# EAGLE design CCR (EAGLE 8.2.2)
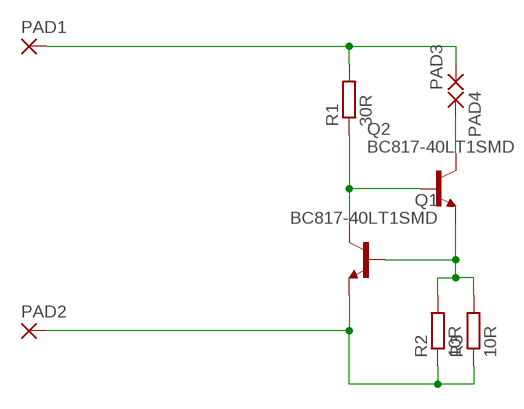
[diagram p0: schematic, sheet 1]

## Parts
PAD1  2,15/1,0  [2,15/1,0]
PAD2  2,15/1,0  [2,15/1,0]
PAD3  2,15/1,0  [2,15/1,0]
PAD4  2,15/1,0  [2,15/1,0]
Q1  BC817-40LT1SMD  [SOT23-BEC]
Q2  BC817-40LT1SMD  [SOT23-BEC]
R1  30R  R_1206  [R1206]
R2  10R  R_1206  [R1206]
R3  10R  R_1206  [R1206]

## Nets
N$1: PAD1.1(P) PAD3.1(P) R1.2
N$2: Q1.C Q2.B R1.1
N$3: PAD4.1(P) Q2.C
N$4: PAD2.1(P) Q1.E R2.1 R3.1
N$5: Q1.B Q2.E R2.2 R3.2

## Library data of the parts
PAD1-PAD4 = wirepad:2,15/1,0: THROUGH-HOLE PAD
Q1 Q2 = transistor-npn:BC817*: NPN Transistor
R1-R3 = Namenlos:R_

## Board
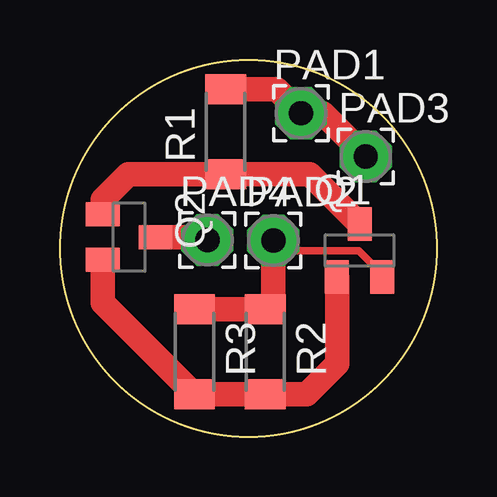
[diagram p1: board, top side]

Size 15.7 x 15.7 mm. Coordinates in mm from the lower left corner, seen from the top.
Outline: circle at 7.85,7.85 radius 7.85
Copper layers (1*16): Top 0.035mm / dielectric 1.5mm / Bottom 0.035mm
Design rules "default": minimum track width 6mil, minimum drill 0.35mm, track to track 6mil, track to pad 6mil, pad to pad 6mil, via to via 6mil, smd to smd 6mil, copper to edge 40mil, drill to drill 6mil, minimum pad ring 10mil, minimum via ring 8mil, stop-mask expansion 4mil, vias tented up to drill 0mil, thermal gap 10mil

### Footprints (pad centres in the part's own frame; a part is rotated, then mirrored left to right if it is on the bottom)
2,15/1,0 = drill 1.016 pad 2.159 octagon: 1 0,0
SOT23-BEC = smd 1 x 1.4: B -0.95,-1.1; C 0,1.1; E 0.95,-1.1
R1206 = smd 1.25 x 1.7: 1 -1.775,0; 2 1.775,0

### Placement (x,y rotation side)
PAD1  10.04,13.48 0 top
PAD2  8.89,8.18 0 top
PAD3  12.74,11.68 0 top
PAD4  6.14,8.2 0 top
Q1  12.48,7.76 0 top
Q2  2.88,8.32 270 top
R1  6.9,12.71 90 top
R2  8.55,3.55 270 top
R3  5.6,3.55 270 top

### Tracks (layer width: path | path; a pad name or v marks a point on that pad's centre or on a via)
N$1
  Top 1.016: R1.2 9.04,14.48 PAD1.1 10.94,13.48 PAD3.1
N$2
  Top 1.016: Q1.C 10.4,10.93 R1.1 2.84,10.93 1.78,9.87 Q2.B
N$3
  Top 1.016: PAD4.1 5.82,8.32 Q2.C
N$4
  Top 0.305: Q1.E 13.43,6.77 12.45,7.75 9.32,7.75 PAD2.1
  Top 1.016: R3.1 R2.1 8.89,5.66 PAD2.1
N$5
  Top 1.016: Q1.B 11.55,6.64 11.55,3.05 10.27,1.77 R2.2 R3.2 1.78,5.59 Q2.E